# Altium schematic sheet Sheet4.SchDoc
size A4
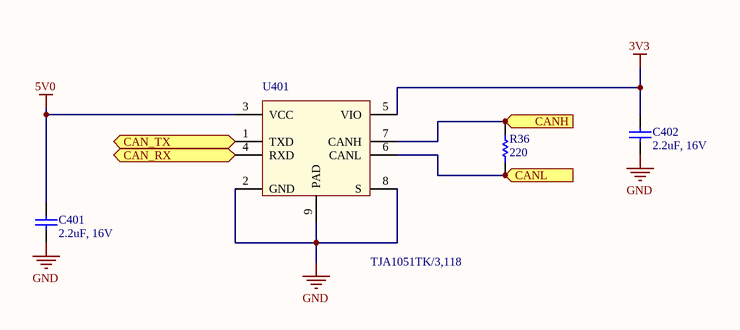
[diagram p0: Sheet4.SchDoc]

## Parts
C401  value 2.2uF, 16V  [SMD-0603 Capacitor]  (hidden comment: Voltage important)
C402  value 2.2uF, 16V  [SMD-0603 Capacitor]  (hidden comment: Voltage important)
R36  220  [SMD-0603 Resistor]
U401  Manufacturer Part Number: TJA1051TK/3,118  [HVSON8]  (hidden comment: CAN_TRANS_1)

## Ports
CAN_RX (out), CAN_TX (in), CANH (in), CANL (in)

## Nets
3V3: C402.2 U401.5(VIO)
5V0: C401.2 U401.3(VCC)
GND: C401.1 C402.1 U401.2(GND) U401.8(S) U401.9(PAD)
CAN_RX: U401.4(RXD) ; port CAN_RX
CAN_TX: U401.1(TXD) ; port CAN_TX
CANH: R36.2 U401.7(CANH) ; port CANH
CANL: R36.1 U401.6(CANL) ; port CANL

## Notes on the sheet
- Title
- Size:
- Date:
- A4
- Number:
- Time:
- Revision:
- Sheet
- of
- File:

## Library data of the parts
C401 C402 = 9: CAP 2.2u, 16V, 0603; Manufacturer Part Number: C1608X5R1C225M; Manufacturer: TDK Corporation; ID: 9; Place (YES/NO): YES
R36 = 386: RES SMD 220 OHM 1% 1/10W 0603; Manufacturer Part Number: ERJ-3EKF2200V; Manufacturer: Panasonic Electronic Components; ID: 386; Place (YES/NO): YES; Value: 220
U401 = 20: IC CAN TRANSEIVER HS 8HVSON; Manufacturer: NXP USA Inc.; ID: 20; Value: Transceiver; Place (YES/NO): YES